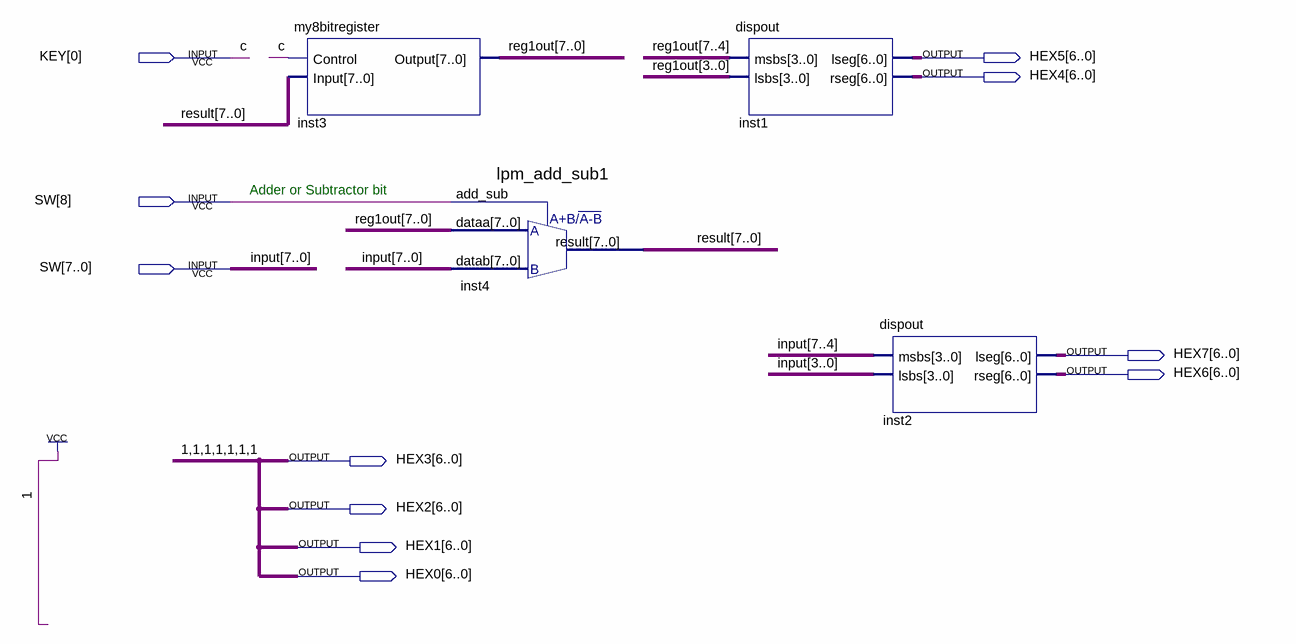
[diagram p0: schematic sheet]
// Quartus schematic Lab5.bdf as structural Verilog: 4 symbols, 11 pins
module Lab5 (
  input  [0:0] KEY,
  input  [8:0] SW,
  output [6:0] HEX5,
  output [6:0] HEX4,
  output [6:0] HEX7,
  output [6:0] HEX6,
  output [6:0] HEX3,
  output [6:0] HEX2,
  output [6:0] HEX1,
  output [6:0] HEX0
);

  wire [7:0] reg1out, result;

  my8bitregister inst3 (.Control(KEY[0]), .Input(result), .Output(reg1out));
  lpm_add_sub1 inst4 (.dataa(reg1out), .datab(SW[7:0]), .add_sub(SW[8]), .result(result));
  dispout inst1 (.msbs(reg1out[7:4]), .lsbs(reg1out[3:0]), .lseg(HEX5), .rseg(HEX4));
  dispout inst2 (.msbs(SW[7:4]), .lsbs(SW[3:0]), .lseg(HEX7), .rseg(HEX6));

  assign HEX0 = {7{1'b1}};
  assign HEX1 = {7{1'b1}};
  assign HEX2 = {7{1'b1}};
  assign HEX3 = {7{1'b1}};

  // Other names for the same wires on the sheet: c = KEY[0]; input[7:0] = SW[7:0]

  // Notes on the sheet:
  //   Adder or Subtractor bit
endmodule
